# EAGLE design Main and Tower (EAGLE 9.6.2)
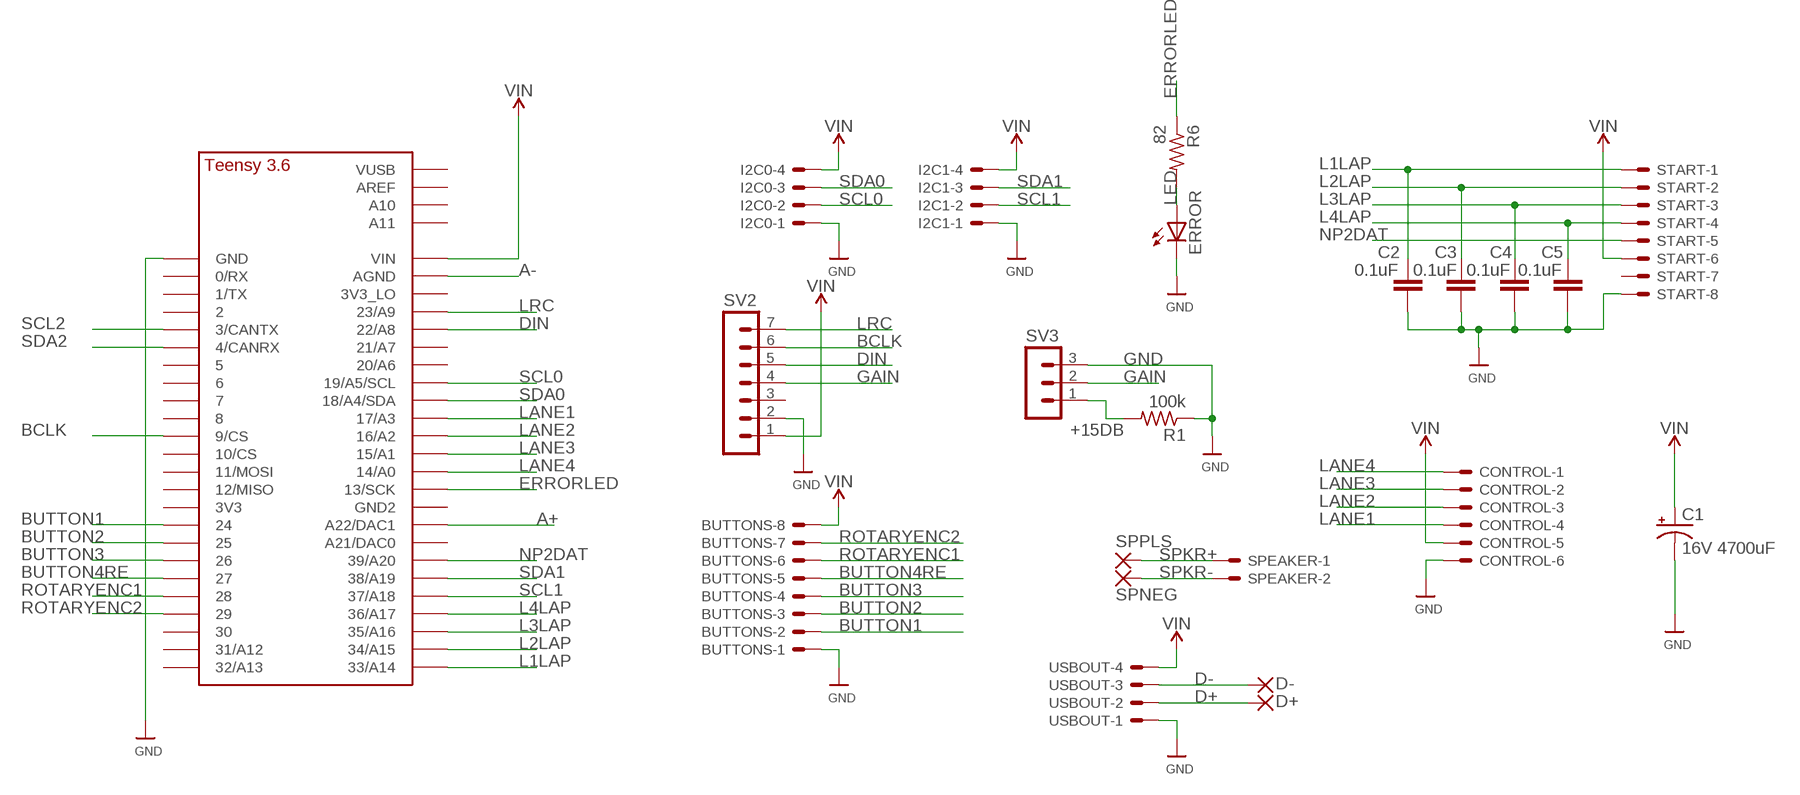
[diagram p0: schematic, sheet 1]

## Parts
BUTTONS  KK-156-8  [KK-156-8]
C1  16V 4700uF  C-POL-US_RADIAL-25MM-DIA  [CAPPRD550W110D1250H2500B]
C2  0.1uF  C_CHIP-1206(3216-METRIC)  [CAPC3216X135]
C3  0.1uF  C_CHIP-1206(3216-METRIC)  [CAPC3216X135]
C4  0.1uF  C_CHIP-1206(3216-METRIC)  [CAPC3216X135]
C5  0.1uF  C_CHIP-1206(3216-METRIC)  [CAPC3216X135]
CONTROL  KK-156-6  [KK-156-6]
D+  1,6/0,8  [1,6/0,8]
D-  1,6/0,8  [1,6/0,8]
ERROR  LEDCHIPLED_1206  [CHIPLED_1206]
I2C0  KK-156-4  [KK-156-4]
I2C1  KK-156-4  [KK-156-4]
R1  100k  R-US_M1206  [M1206]
R6  82  R-US_M1206  [M1206]
SPEAKER  KK-156-2  [KK-156-2]
SPNEG  2,54/1,1  [2,54/1,1]
SPPLS  2,54/1,1  [2,54/1,1]
START  KK-156-8  [KK-156-8]
SV2  MA07-1  [MA07-1]
SV3  MA03-1  [MA03-1]
U$1  TEENSY_3.5/3.6_BASIC  [TEENSY_3.5/3.6_BASIC]
USBOUT  KK-156-4  [KK-156-4]

## Nets
+15DB: R1.2 SV3.1
A+: U$1.A22/DAC1
A-: U$1.AGND
BCLK: SV2.6 U$1.9/CS
BUTTON1: BUTTONS.2 U$1.24
BUTTON2: BUTTONS.3 U$1.25
BUTTON3: BUTTONS.4 U$1.26
BUTTON4RE: BUTTONS.5 U$1.27
D+ [USB]: D+.1(P) USBOUT.2
D- [USB]: D-.1(P) USBOUT.3
DIN: SV2.5 U$1.22/A8
ERRORLED: R6.1 U$1.13/SCK
GAIN: SV2.4 SV3.2
GND: BUTTONS.1 C1.2(-) C2.2 C3.2 C4.2 C5.2 CONTROL.6 ERROR.C I2C0.1 I2C1.1 R1.1 START.8 SV2.2 SV3.3 U$1.GND USBOUT.1
L1LAP: C2.1 START.1 U$1.33/A14
L2LAP: C3.1 START.2 U$1.34/A15
L3LAP: C4.1 START.3 U$1.35/A16
L4LAP: C5.1 START.4 U$1.36/A17
LANE1: CONTROL.4 U$1.17/A3
LANE2: CONTROL.3 U$1.16/A2
LANE3: CONTROL.2 U$1.15/A1
LANE4: CONTROL.1 U$1.14/A0
LED: ERROR.A R6.2
LRC: SV2.7 U$1.23/A9
NP2DAT: START.5 U$1.39/A20
ROTARYENC1: BUTTONS.6 U$1.28
ROTARYENC2: BUTTONS.7 U$1.29
SCL0: I2C0.2 U$1.19/A5/SCL
SCL1: I2C1.2 U$1.37/A18
SCL2: U$1.3/CANTX
SDA0: I2C0.3 U$1.18/A4/SDA
SDA1: I2C1.3 U$1.38/A19
SDA2: U$1.4/CANRX
SPKR+: SPEAKER.1 SPPLS.1(P)
SPKR-: SPEAKER.2 SPNEG.1(P)
VIN: BUTTONS.8 C1.1(+) CONTROL.5 I2C0.4 I2C1.4 START.6 SV2.1 U$1.VIN USBOUT.4
Unconnected: START.7 SV2.3 U$1.0/RX U$1.1/TX U$1.2 U$1.3V3 U$1.3V3_LO U$1.5 U$1.6 U$1.7 U$1.8 U$1.10/CS U$1.11/MOSI U$1.12/MISO U$1.20/A6 U$1.21/A7 U$1.21/DAC0(A21/DAC0) U$1.30 U$1.31/A12 U$1.32/A13 U$1.A10 U$1.A11 U$1.AREF U$1.GND2 U$1.VUSB

## Library data of the parts
BUTTONS START = con-molex:KK-156-8: KK 156 HEADER Source: http://www.molex.com/pdm_docs/sd/026604100_sd.pdf; MF: MOLEX; OC_FARNELL: unknown; OC_NEWARK: unknown
C1 = Capacitor:C-POL-US: Capacitor Polarised - ANSI; CATEGORY: Capacitor
C2-C5 = Capacitor:C: Capacitor - Generic; CATEGORY: Capacitor
CONTROL = con-molex:KK-156-6: KK 156 HEADER Source: http://www.molex.com/pdm_docs/sd/026604100_sd.pdf; MF: MOLEX; OC_FARNELL: unknown; OC_NEWARK: unknown
D+ D- = wirepad:1,6/0,8: THROUGH-HOLE PAD
ERROR = adafruit:LED: LED OSRAM: - CHIPLED LG R971, LG N971, LY N971, LG Q971, LY Q971, LO R971, LY R971 LH N974, LH R974 LS Q976, LO Q976, LY Q976 LO Q996 - Hyper CHIPLED LW Q18S LB Q993, LB Q99A, LB R99A - SideLED LS A670, LO A670, LY A670, LG A670, LP A670 LB A673, LV A673, LT A673, LW A673 LH A674 LY A675 LS A676, LA A676, LO A676, LY A676, LW A676 LS A679, LY A679, LG A679 - Hyper Micro SIDELED® LS Y876, LA Y876, LO Y876, LY Y876 LT Y87S - SmartLED LW L88C, LW L88S LB L89C, LB L89S, LG L890 LS L89K, LO L89K, LY L89K LS L896, LA L896, LO L896, LY L896 - TOPLED LS T670, LO T670, LY T670, LG T670, LP T670 LSG T670, LSP T670, LSY T670, LOP T670, LYG T670 LG T671, LOG T671, LSG T671 LB T673, LV T673, LT T673, LW T673 LH T674 LS T676, LA T676, LO T676, LY T676, LB T676, LH T676, LSB T676, LW T676 LB T67C, LV T67C, LT T67C, LS T67K, LO T67K, LY T67K, LW E67C LS E67B, LA E67B, LO E67B, LY E67B, LB E67C, LV E67C, LT E67C LW T67C LS T679, LY T679, LG T679 LS T770, LO T770, LY T770, LG T770, LP T770 LB T773, LV T773, LT T773, LW T773 LH T774 LS E675, LA E675, LY E675, LS T675 LS T776, LA T776, LO T776, LY T776, LB T776 LHGB T686 LT T68C, LB T68C - Hyper Mini TOPLED® LB M676 - Mini TOPLED Santana® LG M470 LS M47K, LO M47K, LY M47K Source: http://www.osram.convergy.de/
I2C0 I2C1 USBOUT = con-molex:KK-156-4: KK 156 HEADER Source: http://www.molex.com/pdm_docs/sd/026604100_sd.pdf; MF: MOLEX; OC_FARNELL: unknown; OC_NEWARK: unknown
R1 R6 = adafruit:R-US_: RESISTOR, American symbol
SPEAKER = con-molex:KK-156-2: KK 156 HEADER Source: http://www.molex.com/pdm_docs/sd/026604100_sd.pdf; MF: MOLEX; OC_FARNELL: unknown; OC_NEWARK: unknown
SPNEG SPPLS = wirepad:2,54/1,1: THROUGH-HOLE PAD
SV2 = con-lstb:MA07-1: PIN HEADER; OC_FARNELL: unknown; OC_NEWARK: unknown
SV3 = con-lstb:MA03-1: PIN HEADER; OC_FARNELL: unknown; OC_NEWARK: unknown
U$1 = Teensy356:TEENSY_3.5/3.6_BASIC

## Board
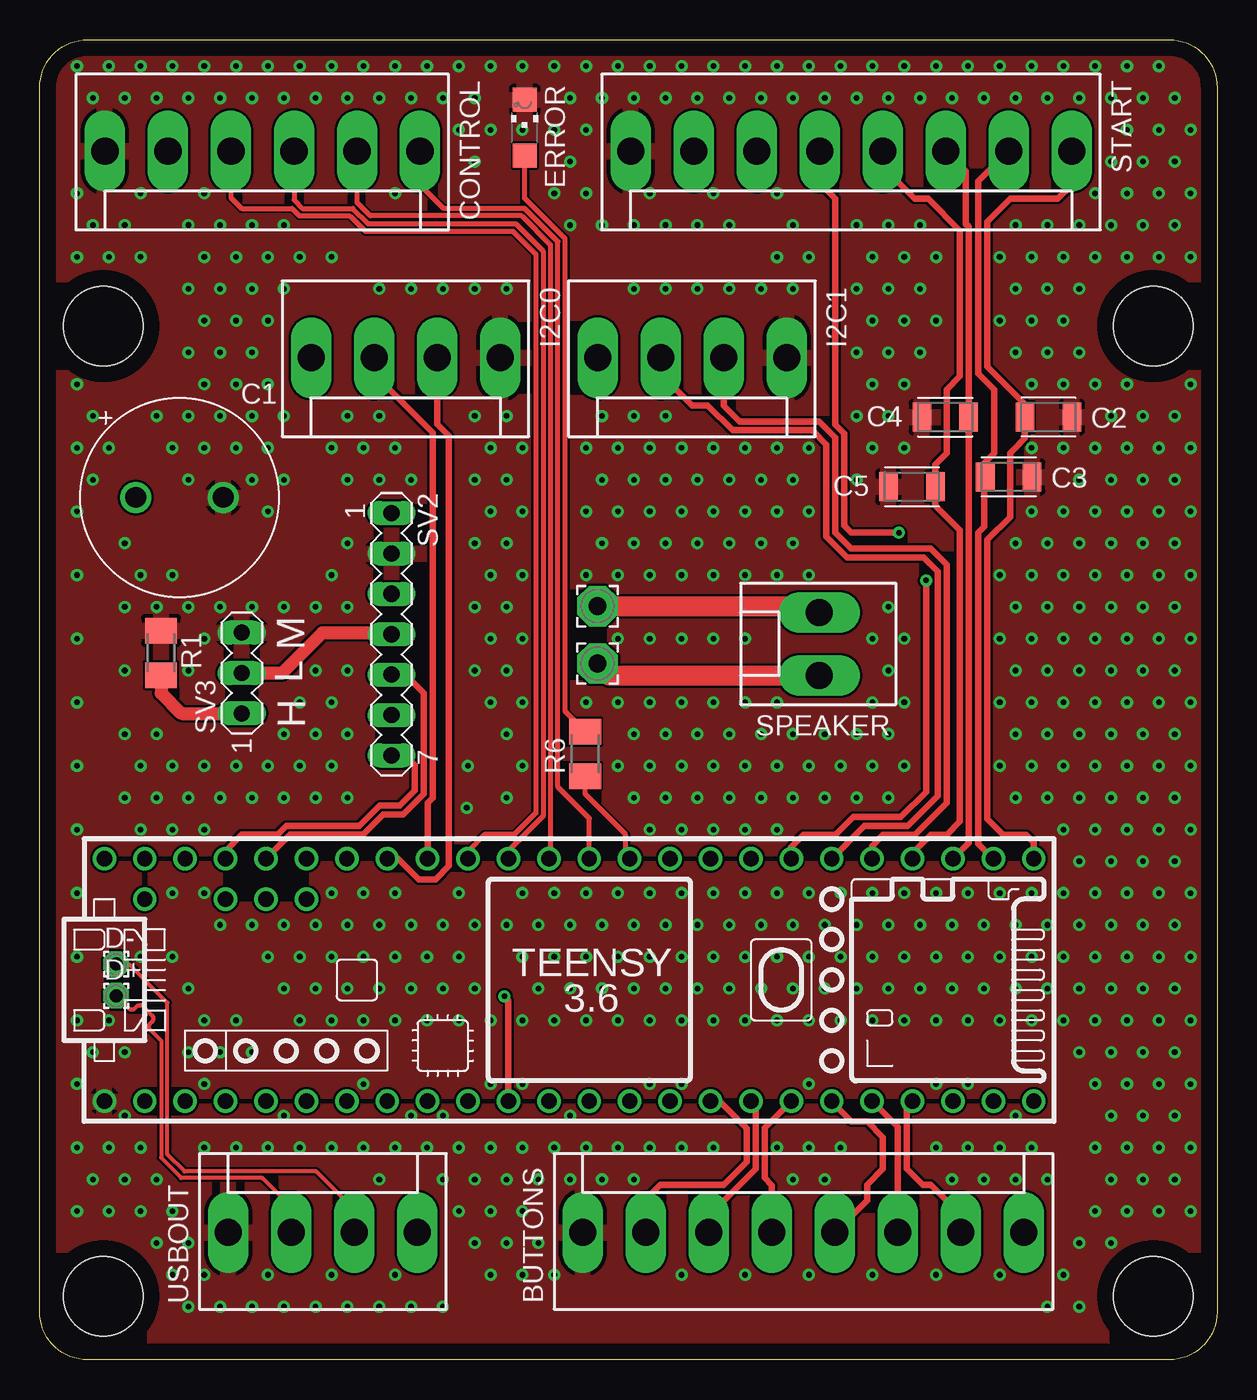
[diagram p1: board, top side]
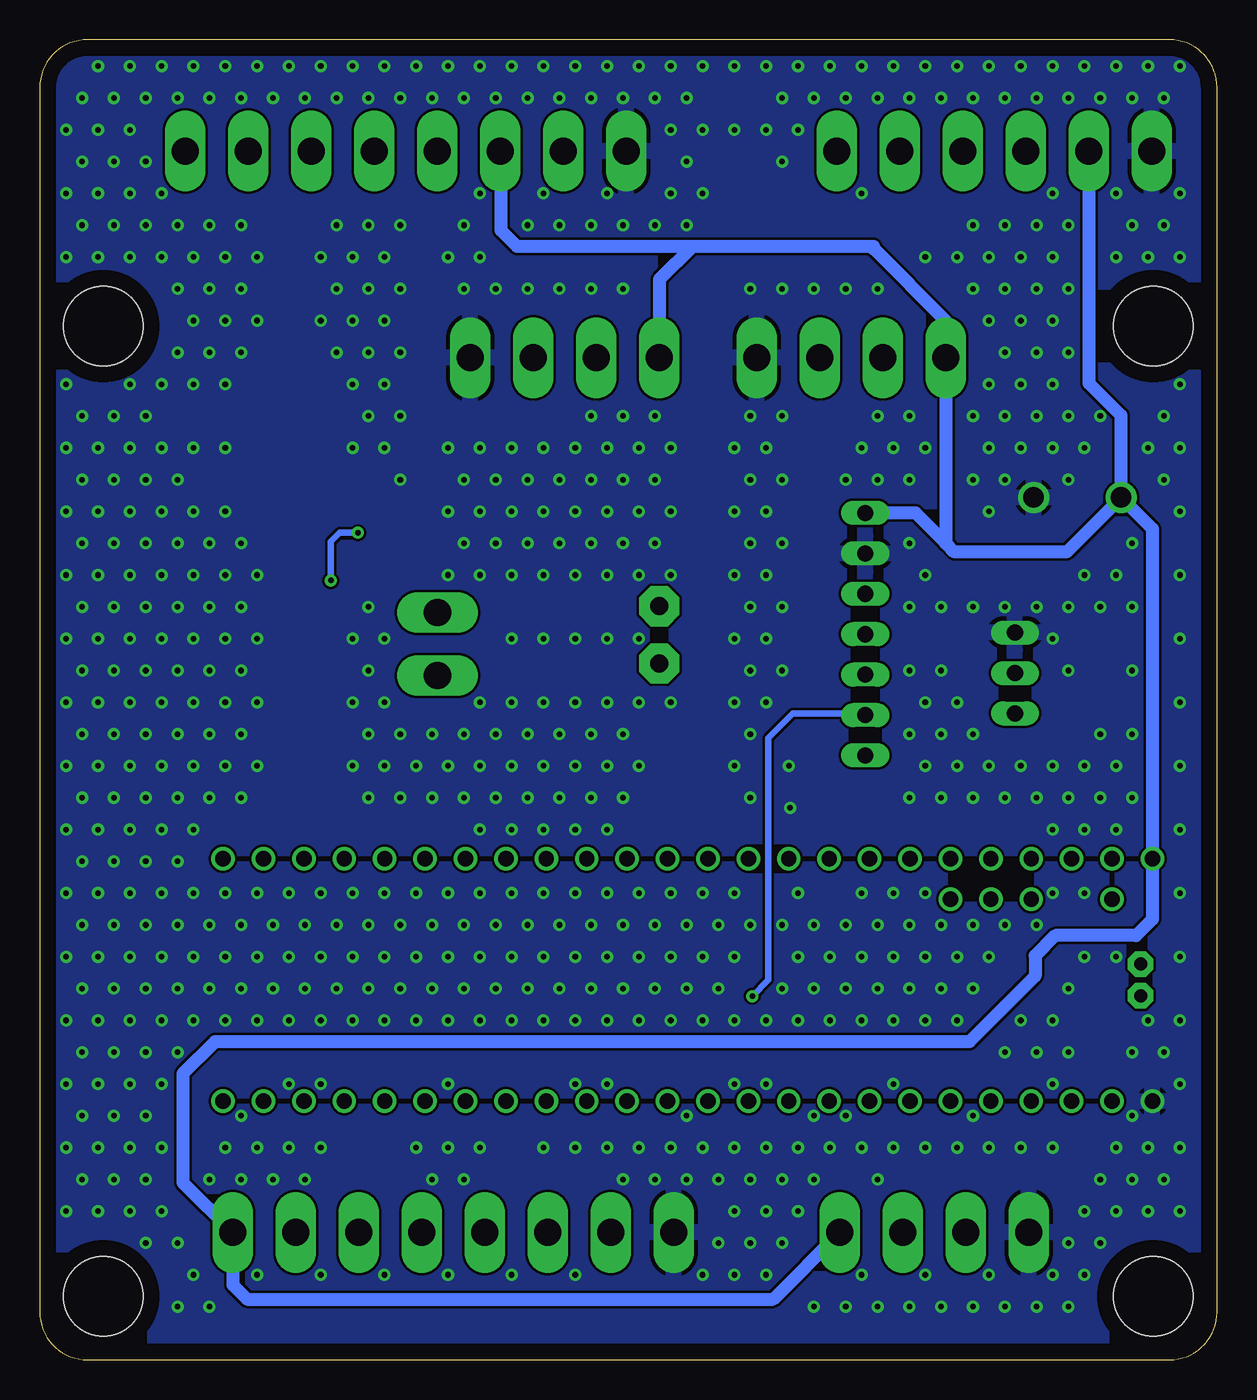
[diagram p2: board, bottom side, seen from below]

Size 74 x 83 mm. Coordinates in mm from the lower left corner, seen from the top.
Outline: 6,83 44,83
Outline: 71,0 3,0 arc-90 0,3 0,80 arc-90 3,83 71,83 arc-90 74,80 74,3 arc-90 71,0
Copper layers (1*16): Top 0.035mm / dielectric 1.5mm / Bottom 0.035mm
Design rules "default *": minimum track width 6mil, minimum drill 0.35mm, track to track 6mil, track to pad 6mil, pad to pad 6mil, via to via 6mil, smd to smd 6mil, copper to edge 40mil, drill to drill 6mil, minimum pad ring 10mil, minimum via ring 8mil, stop-mask expansion 4mil, vias tented up to drill 0.7mm, thermal gap 10mil
Holes 5 mm at 4,65 4,4 70,4 70,65

### Footprints (pad centres in the part's own frame; a part is rotated, then mirrored left to right if it is on the bottom)
KK-156-8 = drill 1.7 pad 2.184 long: 1 -13.86,0; 2 -9.9,0; 3 -5.94,0; 4 -1.98,0; 5 1.98,0; 6 5.94,0; 7 9.9,0; 8 13.86,0
CAPPRD550W110D1250H2500B = drill 1.3 pad 1.95: 1 -2.75,0; 2 2.75,0
CAPC3216X135 = smd 1.165 x 1.815: 1 -1.475,0; 2 1.475,0
KK-156-6 = drill 1.7 pad 2.184 long: 1 -9.9,0; 2 -5.94,0; 3 -1.98,0; 4 1.98,0; 5 5.94,0; 6 9.9,0
1,6/0,8 = drill 0.813 pad 1.6 octagon: 1 0,0
CHIPLED_1206 = smd 1.5 x 1.5: A 0,-1.75; C 0,1.75
KK-156-4 = drill 1.7 pad 2.184 long: 1 -5.94,0; 2 -1.98,0; 3 1.98,0; 4 5.94,0
M1206 = smd 1.6 x 2: 1 -1.4,0; 2 1.4,0
KK-156-2 = drill 1.7 pad 2.184 long: 1 -1.98,0; 2 1.98,0
2,54/1,1 = drill 1.118 pad 2.54 octagon: 1 0,0
MA07-1 = drill 1.016 long: 1 -7.62,0; 2 -5.08,0; 3 -2.54,0; 4 0,0; 5 2.54,0; 6 5.08,0; 7 7.62,0
MA03-1 = drill 1.016 long: 1 -2.54,0; 2 0,0; 3 2.54,0
TEENSY_3.5/3.6_BASIC = drill 0.965: 0/RX -25.4,-7.62; 1/TX -22.86,-7.62; 2 -20.32,-7.62; 3/CANTX -17.78,-7.62; 3V3 7.62,-7.62; 3V3_LO -22.86,7.62; 4/CANRX -15.24,-7.62; 5 -12.7,-7.62; 6 -10.16,-7.62; 7 -7.62,-7.62; 8 -5.08,-7.62; 9/CS -2.54,-7.62; 10/CS 0,-7.62; 11/MOSI 2.54,-7.62; 12/MISO 5.08,-7.62; 13/SCK 5.08,7.62; 14/A0 2.54,7.62; 15/A1 0,7.62; 16/A2 -2.54,7.62; 17/A3 -5.08,7.62; 18/A4/SDA -7.62,7.62; 19/A5/SCL -10.16,7.62; 20/A6 -12.7,7.62; 21/A7 -15.24,7.62; 21/DAC0 12.7,7.62; 22/A8 -17.78,7.62; 23/A9 -20.32,7.62; 24 10.16,-7.62; 25 12.7,-7.62; 26 15.24,-7.62; 27 17.78,-7.62; 28 20.32,-7.62; 29 22.86,-7.62; 30 25.4,-7.62; 31/A12 27.94,-7.62; 32/A13 30.48,-7.62; 33/A14 30.48,7.62; 34/A15 27.94,7.62; 35/A16 25.4,7.62; 36/A17 22.86,7.62; 37/A18 20.32,7.62; 38/A19 17.78,7.62; 39/A20 15.24,7.62; A10 -17.78,5.08; A11 -15.24,5.08; A22/DAC1 10.16,7.62; AGND -25.4,7.62; AREF -20.32,5.08; GND -27.94,-7.62; GND2 7.62,7.62; VIN -27.94,7.62; VUSB -25.4,5.08

### Placement (x,y rotation side)
BUTTONS  48,8 0 top
C1  8.78,54.22 0 top
C2  63.4,59.27 0 top
C3  60.91,55.51 0 top
C4  56.91,59.27 180 top
C5  54.81,54.9 180 top
CONTROL  14,76 180 top
D+  4.8,22.88 0 top
D-  4.8,24.88 0 top
ERROR  30.48,77.47 0 top
I2C0  23,63 180 top
I2C1  41,63 180 top
R1  7.62,44.45 270 top
R6  34.29,38.1 90 top
SPEAKER  49,45 90 top
SPNEG  35.06,47.39 180 top
SPPLS  35.06,43.78 180 top
START  51,76 180 top
SV2  22.11,45.62 270 top
SV3  12.7,43.18 90 top
U$1  32,23.88 0 top
USBOUT  17.78,8 0 top

### Tracks (layer width: path | path; a pad name or v marks a point on that pad's centre or on a via)
+15DB
  Top 0.813: R1.2 7.62,41.91 8.89,40.64 SV3.1
BCLK  (via drill 0.35)
  Top 0.406: v29.21,22.86 29.46,22.61 U$1.9/CS
  Bottom 0.406: SV2.6 22.21,40.64 26.67,40.64 28.2,39.11 28.2,23.87 v29.21,22.86
BUTTON1
  Top 0.406: BUTTONS.2 38.1,10.1 39,11 43,11 44.44,12.44 44.44,14.56 42.74,16.26 U$1.24
BUTTON2
  Top 0.406: BUTTONS.3 42.06,9.06 45,12 45,15.96 U$1.25
BUTTON3
  Top 0.406: BUTTONS.4 46.02,10.98 45.56,11.44 45.56,14.58 U$1.26
BUTTON4RE
  Top 0.406: BUTTONS.5 52,10.02 52,11 53,12 53,14 52,15 51,15 49.78,16.22 U$1.27
D+
  Top 0.254: D+.1 5.58,22.1 arc90 5.98,22.1 6.09,22.21 arc-90 6.49,22.21 7.08,21.62 arc-90 7.08,21.27 6.94,21.14 arc90 6.94,20.74 7.62,20.06 7.62,12.7 8.89,11.43 13.97,11.43 14.76,10.64 | USBOUT.2 15.8,9.6 14.76,10.64 | 14.76,10.64
D-
  Top 0.254: USBOUT.3 19.76,9.45 17.37,11.84 9.11,11.84 8.03,12.92 8.03,22.45 5.6,24.88 D-.1
DIN
  Top 0.406: SV2.5 22.96,43.08 24.13,41.91 24.13,35.56 22.86,34.29 21.59,34.29 20.32,33.02 15.74,33.02 U$1.22/A8
ERRORLED
  Top 0.305: U$1.13/SCK 36.83,31.75 36.83,33.02 34.29,35.56 R6.1
GAIN
  Top 0.813: SV3.2 15.24,43.18 17.78,45.72 22.01,45.72 SV2.4
GND  (via drill 0.35)
  other vias: 2.34,9.34 2.34,13.34 2.34,17.34 2.34,21.34 2.34,25.34 2.34,29.34 2.34,33.34 2.34,37.34 2.34,41.34 2.34,45.34 2.34,49.34 2.34,53.34 2.34,57.34 2.34,61.34 2.34,69.34 2.34,73.34 2.34,81.34 4.34,9.34 3.34,11.34 4.34,13.34 3.34,19.34 4.34,21.34 3.34,55.34 4.34,57.34 3.34,59.34 4.34,69.34 3.34,71.34 3.34,79.34 4.34,81.34 6.34,9.34 5.34,11.34 6.34,13.34 5.34,15.34 5.34,19.34 6.34,25.34 6.34,33.34 5.34,35.34 6.34,37.34 5.34,39.34 5.34,43.34 5.34,47.34 6.34,49.34 5.34,51.34 6.34,69.34 5.34,71.34 6.34,73.34 5.34,79.34 6.34,81.34 8.34,5.34 7.34,7.34 8.34,9.34 7.34,11.34 8.34,25.34 8.34,29.34 8.34,33.34 7.34,35.34 8.34,37.34 7.34,39.34 7.34,47.34 8.34,49.34 8.34,57.34 7.34,59.34 7.34,79.34 8.34,81.34 9.34,3.34 10.34,5.34 9.34,7.34 10.34,13.34 10.34,17.34 9.34,19.34 10.34,21.34 9.34,23.34 10.34,29.34 10.34,33.34 9.34,35.34 10.34,37.34 9.34,43.34 10.34,45.34 9.34,47.34 9.34,55.34 10.34,57.34 9.34,59.34 10.34,61.34 9.34,63.34 10.34,65.34 9.34,67.34 10.34,69.34 9.34,71.34 10.34,73.34 9.34,79.34 10.34,81.34 11.34,3.34 12.34,13.34 11.34,19.34 12.34,21.34 11.34,27.34 11.34,35.34 12.34,37.34 11.34,47.34 12.34,57.34 11.34,59.34 12.34,61.34 11.34,63.34 12.34,65.34 11.34,67.34 12.34,69.34 11.34,71.34 11.34,79.34 12.34,81.34 13.34,3.34 14.34,5.34 14.34,13.34 13.34,19.34 14.34,25.34 13.34,27.34 13.34,35.34 14.34,37.34 13.34,47.34 14.34,53.34 13.34,55.34 14.34,57.34 13.34,59.34 14.34,61.34 13.34,63.34 14.34,65.34 13.34,67.34 14.34,69.34 13.34,71.34 13.34,79.34 14.34,81.34 15.34,3.34 16.34,13.34 15.34,15.34 16.34,21.34 15.34,23.34 16.34,25.34 15.34,27.34 15.34,35.34 16.34,37.34 15.34,39.34 16.34,41.34 15.34,47.34 15.34,55.34 15.34,59.34 15.34,67.34 16.34,69.34 15.34,71.34 15.34,79.34 16.34,81.34 17.34,3.34 18.34,5.34 18.34,13.34 18.34,21.34 17.34,23.34 18.34,25.34 17.34,27.34 18.34,29.34 17.34,35.34 18.34,37.34 17.34,39.34 18.34,41.34 17.34,43.34 17.34,47.34 18.34,49.34 18.34,57.34 18.34,69.34 17.34,79.34 18.34,81.34 19.34,3.34 20.34,13.34 20.34,17.34 20.34,21.34 19.34,23.34 20.34,25.34 19.34,27.34 20.34,29.34 19.34,35.34 19.34,39.34 19.34,43.34 19.34,47.34 19.34,51.34 19.34,55.34 20.34,57.34 19.34,59.34 19.34,79.34 20.34,81.34 21.34,3.34 22.34,5.34 21.34,11.34 22.34,13.34 22.34,21.34 21.34,23.34 22.34,25.34 21.34,27.34 22.34,29.34 21.34,55.34 22.34,57.34 21.34,59.34 21.34,67.34 22.34,73.34 21.34,79.34 22.34,81.34 23.34,3.34 24.34,13.34 23.34,15.34 24.34,21.34 23.34,23.34 24.34,25.34 23.34,27.34 23.34,55.34 23.34,67.34 23.34,79.34 24.34,81.34 25.34,3.34 26.34,9.34 25.34,11.34 26.34,13.34 25.34,15.34 26.34,21.34 25.34,23.34 26.34,25.34 25.34,27.34 26.34,29.34 26.84,34.71 26.91,37.34 25.34,67.34 26.34,77.34 25.34,79.34 26.34,81.34 28.34,5.34 27.34,7.34 28.34,9.34 27.34,11.34 28.34,13.34 28.34,17.34 28.34,21.34 27.34,23.34 27.34,27.34 28.34,41.34 27.34,43.34 28.34,45.34 27.34,47.34 28.34,49.34 27.34,51.34 28.34,53.34 27.34,55.34 28.34,57.34 27.34,59.34 27.34,67.34 27.34,75.34 28.34,77.34 27.34,79.34 28.34,81.34 30.34,5.34 29.34,7.34 30.34,9.34 29.34,11.34 30.34,13.34 30.34,17.34 30.34,21.34 30.34,25.34 29.34,27.34 30.34,29.34 29.34,35.34 30.34,37.34 29.34,39.34 30.34,41.34 29.34,43.34 30.34,45.34 29.34,47.34 30.34,49.34 29.34,51.34 30.34,53.34 29.34,55.34 30.34,57.34 29.34,59.34 29.34,67.34 30.34,77.34 30.34,81.34 32.34,5.34 31.34,7.34 31.34,11.34 32.34,13.34 32.34,21.34 31.34,23.34 32.34,25.34 31.34,27.34 32.34,29.34 32.34,73.34 32.34,77.34 32.34,81.34 33.34,11.34 34.34,13.34 33.34,15.34 34.34,21.34 33.34,23.34 34.34,25.34 33.34,27.34 34.34,29.34 34.34,41.34 34.34,49.34 34.34,53.34 34.34,57.34 33.34,71.34 34.34,73.34 33.34,75.34 34.34,77.34 33.34,79.34 34.34,81.34 35.34,11.34 36.34,13.34 36.34,21.34 35.34,23.34 36.34,25.34 35.34,27.34 36.34,29.34 36.34,37.34 36.34,41.34 36.34,45.34 36.34,49.34 35.34,51.34 36.34,53.34 35.34,55.34 36.34,57.34 35.34,59.34 35.34,71.34 35.34,79.34 36.34,81.34 37.34,11.34 38.34,13.34 38.34,17.34 38.34,21.34 37.34,23.34 38.34,25.34 37.34,27.34 38.34,29.34 38.34,33.34 37.34,35.34 38.34,37.34 37.34,39.34 38.34,41.34 38.34,45.34 38.34,49.34 37.34,51.34 38.34,53.34 37.34,55.34 38.34,57.34 37.34,59.34 37.34,67.34 37.34,71.34 38.34,73.34 37.34,79.34 38.34,81.34 40.34,5.34 40.34,13.34 40.34,17.34 40.34,21.34 39.34,23.34 40.34,25.34 39.34,27.34 40.34,29.34 40.34,33.34 39.34,35.34 40.34,37.34 39.34,39.34 40.34,41.34 40.34,45.34 40.34,49.34 39.34,51.34 40.34,53.34 39.34,55.34 40.34,57.34 39.34,59.34 39.34,67.34 39.34,71.34 39.34,79.34 40.34,81.34 42.34,13.34 42.34,21.34 41.34,23.34 42.34,25.34 41.34,27.34 42.34,29.34 42.34,33.34 41.34,35.34 42.34,37.34 41.34,39.34 42.34,41.34 42.34,45.34 42.34,49.34 41.34,51.34 42.34,53.34 41.34,55.34 42.34,57.34 41.34,67.34 41.34,71.34 42.34,73.34 41.34,79.34 42.34,81.34 44.34,5.34 44.34,21.34 43.34,23.34 44.34,25.34 43.34,27.34 44.34,29.34 44.34,33.34 43.34,35.34 44.34,37.34 43.34,39.34 44.34,41.34 44.34,45.34 44.34,49.34 43.34,51.34 44.34,53.34 43.34,55.34 44.34,57.34 43.34,67.34 43.34,71.34 43.34,79.34 44.34,81.34 46.34,13.34 46.34,21.34 45.34,23.34 46.34,25.34 45.34,27.34 46.34,29.34 46.34,33.34 45.34,35.34 46.34,37.34 45.34,39.34 46.34,41.34 46.34,49.34 45.34,51.34 46.34,53.34 45.34,55.34 46.34,57.34 45.34,67.34 46.34,69.34 46.34,73.34 45.34,79.34 46.34,81.34 48.34,5.34 47.34,11.34 48.34,13.34 48.34,17.34 48.34,21.34 47.34,23.34 48.34,25.34 47.34,27.34 48.34,29.34 47.34,35.34 48.34,37.34 47.34,39.34 48.34,49.34 47.34,51.34 48.34,53.34 47.34,55.34 48.34,57.34 47.34,67.34 48.34,69.34 47.34,71.34 47.34,79.34 48.34,81.34 49.34,11.34 50.34,13.34 50.34,21.34 49.34,23.34 50.34,25.34 49.34,27.34 50.34,29.34 49.34,35.34 50.34,37.34 49.34,39.34 49.34,79.34 50.34,81.34 52.34,5.34 52.34,21.34 51.34,23.34 52.34,25.34 51.34,27.34 52.34,29.34 51.34,35.34 52.34,37.34 51.34,39.34 52.34,41.34 52.34,45.34 51.34,55.34 52.34,57.34 51.34,59.34 52.34,61.34 51.34,63.34 52.34,65.34 51.34,67.34 52.34,69.34 51.34,71.34 51.34,79.34 52.34,81.34 54.34,21.34 53.34,23.34 54.34,25.34 53.34,27.34 54.34,29.34 53.34,35.34 54.34,37.34 53.34,39.34 54.34,41.34 53.34,43.34 54.34,45.34 53.34,47.34 54.34,57.34 53.34,59.34 54.34,61.34 53.34,63.34 54.34,65.34 53.34,67.34 54.34,69.34 53.34,71.34 53.34,79.34 54.34,81.34 56.34,5.34 56.34,13.34 56.34,17.34 56.34,21.34 55.34,23.34 56.34,25.34 55.34,27.34 56.34,29.34 55.34,63.34 56.34,65.34 55.34,67.34 56.34,69.34 55.34,71.34 55.34,79.34 56.34,81.34 57.34,11.34 58.34,13.34 58.34,17.34 58.34,21.34 57.34,23.34 58.34,25.34 57.34,27.34 58.34,29.34 57.34,79.34 58.34,81.34 60.34,5.34 59.34,11.34 60.34,13.34 60.34,21.34 59.34,23.34 60.34,25.34 59.34,27.34 60.34,29.34 60.34,37.34 60.34,41.34 60.34,45.34 60.34,49.34 60.34,65.34 60.34,69.34 59.34,79.34 60.34,81.34 61.34,11.34 62.34,13.34 61.34,15.34 62.34,21.34 61.34,23.34 62.34,25.34 61.34,27.34 62.34,29.34 61.34,35.34 62.34,37.34 61.34,39.34 62.34,41.34 61.34,43.34 62.34,45.34 61.34,47.34 62.34,49.34 61.34,51.34 62.34,53.34 62.34,57.34 62.34,61.34 61.34,63.34 62.34,65.34 61.34,67.34 62.34,69.34 61.34,71.34 61.34,79.34 62.34,81.34 63.34,3.34 64.34,5.34 63.34,11.34 64.34,21.34 63.34,23.34 64.34,25.34 63.34,27.34 64.34,29.34 64.34,33.34 63.34,35.34 64.34,37.34 63.34,39.34 64.34,41.34 63.34,43.34 64.34,45.34 63.34,47.34 64.34,49.34 63.34,51.34 64.34,53.34 64.34,57.34 64.34,61.34 63.34,63.34 64.34,65.34 63.34,67.34 64.34,69.34 63.34,71.34 63.34,79.34 64.34,81.34 65.34,3.34 65.34,7.34 66.34,9.34 66.34,13.34 66.34,17.34 65.34,19.34 66.34,21.34 65.34,23.34 66.34,25.34 65.34,27.34 66.34,29.34 65.34,31.34 66.34,33.34 65.34,35.34 66.34,37.34 65.34,39.34 66.34,41.34 65.34,43.34 66.34,45.34 65.34,47.34 66.34,49.34 65.34,51.34 66.34,53.34 65.34,55.34 66.34,57.34 66.34,61.34 65.34,63.34 65.34,67.34 66.34,69.34 65.34,71.34 66.34,73.34 65.34,79.34 66.34,81.34 67.34,7.34 68.34,9.34 67.34,11.34 68.34,13.34 67.34,15.34 68.34,17.34 67.34,19.34 68.34,21.34 67.34,23.34 68.34,25.34 67.34,27.34 68.34,29.34 67.34,31.34 68.34,33.34 67.34,35.34 68.34,37.34 67.34,39.34 68.34,41.34 67.34,43.34 68.34,45.34 67.34,47.34 68.34,49.34 67.34,51.34 68.34,53.34 67.34,55.34 68.34,57.34 67.34,59.34 68.34,61.34 68.34,69.34 67.34,71.34 68.34,73.34 67.34,75.34 68.34,77.34 67.34,79.34 68.34,81.34 70.34,9.34 69.34,11.34 70.34,13.34 69.34,15.34 70.34,17.34 69.34,19.34 70.34,21.34 69.34,23.34 70.34,25.34 69.34,27.34 70.34,29.34 69.34,31.34 70.34,33.34 69.34,35.34 70.34,37.34 69.34,39.34 70.34,41.34 69.34,43.34 70.34,45.34 69.34,47.34 70.34,49.34 69.34,51.34 70.34,53.34 69.34,55.34 70.34,57.34 69.34,59.34 70.34,69.34 69.34,71.34 70.34,73.34 69.34,75.34 70.34,77.34 69.34,79.34 70.34,81.34 72.34,9.34 71.34,11.34 72.34,13.34 71.34,15.34 72.34,17.34 71.34,19.34 72.34,21.34 71.34,23.34 72.34,25.34 71.34,27.34 72.34,29.34 71.34,31.34 72.34,33.34 71.34,35.34 72.34,37.34 71.34,39.34 72.34,41.34 71.34,43.34 72.34,45.34 71.34,47.34 72.34,49.34 71.34,51.34 72.34,53.34 71.34,55.34 72.34,57.34 71.34,59.34 72.34,61.34 72.34,69.34 71.34,71.34 72.34,73.34 71.34,75.34 72.34,77.34 71.34,79.34
  pour Top: 0,0 0,83 74,83 74,0
  pour Bottom: 0,0 0,83 1,83 74,83 74,0
L1LAP
  Top 0.406: U$1.33/A14 62.48,32.52 62,33 60.56,33 59.56,34 59.56,51.56 61,53 61,57 61.61,57.61 61.61,57.64 61.92,57.96 C2.1 61.92,60.08 59.56,62.44 59.56,71.56 61,73 64,73 64.86,73.86 START.1
L2LAP
  Top 0.406: U$1.34/A15 59,32.44 59,52 59.38,52.38 59.38,55.46 | START.2 59,74.1 59,62 60,61 60,57 59.38,56.38 59.38,55.46 | 59.38,55.46 C3.1
L3LAP
  Top 0.406: U$1.35/A16 58.4,32.5 C4.1 | START.3 58.22,74.72 58.22,71.42 58.4,71.23 C4.1 | C4.1
L4LAP
  Top 0.406: U$1.36/A17 54.86,31.86 56,33 57,33 57.84,33.84 57.84,52.16 56.29,53.71 C5.1 56.29,56.29 57,57 57,61 57.84,61.84 57.84,71 55.84,73 55,73 52.98,75.02 START.4
LANE1
  Top 0.305: CONTROL.4 12.02,73.07 12.7,72.39 15.86,72.39 16.32,71.93 19.48,71.93 20.45,70.96 29.73,70.96 31.19,69.51 31.19,34.37 29.83,33.02 27.94,33.02 26.92,32 U$1.17/A3
LANE2
  Top 0.305: CONTROL.3 15.98,72.92 16.51,72.39 19.67,72.39 20.64,71.42 29.92,71.42 31.64,69.7 31.64,34.18 29.46,32 U$1.16/A2
LANE3
  Top 0.305: U$1.15/A1 32.1,31.6 32.1,70.12 30.29,71.93 20.78,71.93 19.94,72.77 CONTROL.2
LANE4
  Top 0.305: U$1.14/A0 34.54,34.04 32.56,36.02 32.56,70.31 30.48,72.39 25.4,72.39 23.9,73.89 CONTROL.1
LED
  Top 0.305: R6.2 33.02,40.77 33.02,70.5 30.48,73.04 ERROR.A
LRC
  Top 0.406: U$1.23/A9 11.68,32 12.7,33.02 14.95,33.02 15.51,33.58 20.09,33.58 21.36,34.85 22.63,34.85 23.57,35.79 23.57,37.39 22.86,38.1 22.21,38.1 SV2.7
NP2DAT  (via drill 0.35)
  Top 0.406: START.5 49.02,73.98 50,73 50,58.79 50.56,58.23 50.56,52.44 51,52 v54,52 | v55.71,49 55.71,35.71 54.12,34.12 51.12,34.12 50,33 48,33 47.24,32.24 U$1.39/A20
  Bottom 0.406: v55.71,49 55.71,51.44 55.15,52 v54,52
ROTARYENC1
  Top 0.406: BUTTONS.6 53.94,14.64 U$1.28
ROTARYENC2
  Top 0.406: BUTTONS.7 57.9,9.1 56,11 55.5,11 54.5,12 54.5,15.9 U$1.29
SCL0
  Top 0.406: U$1.19/A5/SCL 22.54,31.5 23.83,30.21 24.88,30.21 25.72,31.05 25.72,31.75 25.72,31.95 25.72,58.1 24.98,58.84 I2C0.2
SCL1
  Top 0.406: I2C1.2 43,62.98 43,60 44,59 49,59 50,58 50,52 51,51 56,51 57,50 57,35 55,33 53,33 52.32,32.32 U$1.37/A18
SDA0
  Top 0.406: I2C0.3 21.02,61.98 24.36,58.65 24.69,58.31 24.69,35.33 24.38,35.02 U$1.18/A4/SDA
SDA1
  Top 0.406: U$1.38/A19 51.84,33.56 54.56,33.56 56.44,35.44 56.44,49.56 55.56,50.44 50.77,50.44 49.44,51.77 49.44,57.56 48.56,58.44 43.56,58.44 42,60 41,60 39.02,61.98 I2C1.3
SPKR+
  Top 1.27: SPPLS.1 35.82,43.02 SPEAKER.1
SPKR-
  Top 1.27: SPNEG.1 48.59,47.39 SPEAKER.2
VIN
  Bottom 0.813: CONTROL.5 8.06,61.4 6.03,59.37 C1.1 | 33,70 21.59,70 21.59,69.85 17.06,65.32 I2C0.4 17.06,51.35 | 33,70 44,70 45,71 45,76 START.6 | 33,70 35.06,67.94 I2C1.4 | C1.1 4.06,52.25 U$1.VIN 4.06,27.69 5.08,26.67 10.16,26.67 11.43,25.4 11.43,24.13 15.56,20 63,20 65,18 65,11.14 BUTTONS.8 61.86,4.71 60.96,3.81 27.91,3.81 USBOUT.4 | C1.1 9.45,50.8 16.51,50.8 17.06,51.35 | SV2.1 18.95,53.24 17.06,51.35

### Text on the board
tNames: M | L | H